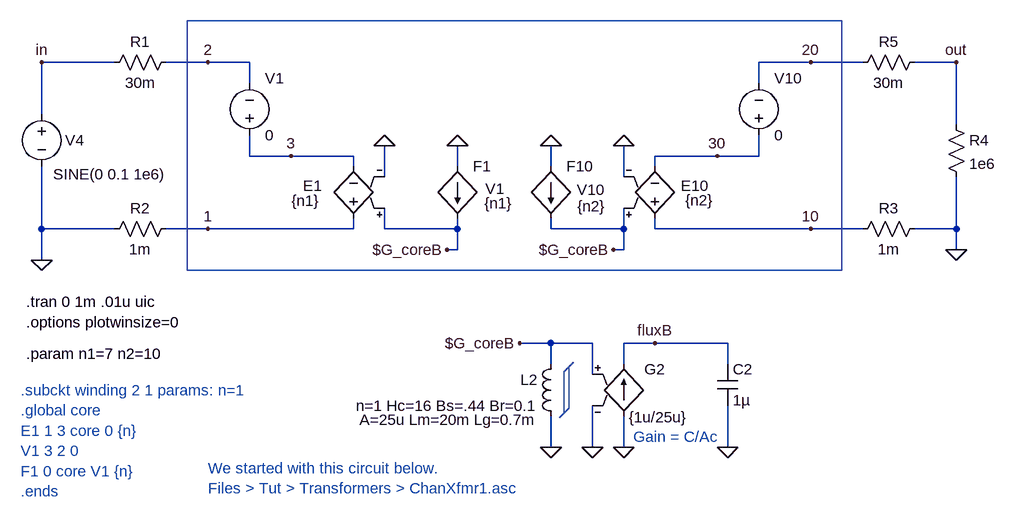
[diagram p0: schematic ChanXfmr_translation1.asc]
ChanXfmr_translation1.asc, the LTspice schematic file:
Version 4
SHEET 1 2500 960
WIRE 1136 112 1024 112
WIRE 1280 112 1216 112
WIRE 1344 112 1280 112
WIRE 2208 112 2128 112
WIRE 2288 112 2208 112
WIRE 2432 112 2368 112
WIRE 1344 144 1344 112
WIRE 2128 144 2128 112
WIRE 1024 192 1024 112
WIRE 2432 208 2432 112
WIRE 1344 256 1344 224
WIRE 1408 256 1344 256
WIRE 1504 256 1408 256
WIRE 2064 256 1968 256
WIRE 2128 256 2128 224
WIRE 2128 256 2064 256
WIRE 1504 272 1504 256
WIRE 1664 272 1664 240
WIRE 1808 272 1808 240
WIRE 1968 272 1968 256
WIRE 1552 288 1552 240
WIRE 1920 288 1920 240
WIRE 1024 368 1024 272
WIRE 1136 368 1024 368
WIRE 1280 368 1216 368
WIRE 1504 368 1504 352
WIRE 1504 368 1280 368
WIRE 1552 368 1552 336
WIRE 1664 368 1664 352
WIRE 1664 368 1552 368
WIRE 1808 368 1808 352
WIRE 1920 368 1920 336
WIRE 1920 368 1808 368
WIRE 1968 368 1968 352
WIRE 2208 368 1968 368
WIRE 2288 368 2208 368
WIRE 2432 368 2432 288
WIRE 2432 368 2368 368
WIRE 1664 400 1664 368
WIRE 1664 400 1648 400
WIRE 1920 400 1920 368
WIRE 1920 400 1904 400
WIRE 2432 400 2432 368
WIRE 1024 416 1024 368
WIRE 1808 544 1760 544
WIRE 1872 544 1808 544
WIRE 1968 544 1920 544
WIRE 2080 544 1968 544
WIRE 1808 576 1808 544
WIRE 1920 576 1920 544
WIRE 2080 576 2080 544
WIRE 1872 592 1872 544
WIRE 1808 704 1808 656
WIRE 1872 704 1872 640
WIRE 1920 704 1920 656
WIRE 2080 704 2080 640
FLAG 1808 704 0
FLAG 1872 704 0
FLAG 1920 704 0
FLAG 2080 704 0
FLAG 1968 544 fluxB
FLAG 1760 544 $G_coreB
FLAG 1648 400 $G_coreB
FLAG 1280 368 1
FLAG 1408 256 3
FLAG 1552 240 0
FLAG 1280 112 2
FLAG 1664 240 0
FLAG 1904 400 $G_coreB
FLAG 2208 368 10
FLAG 2064 256 30
FLAG 1920 240 0
FLAG 2208 112 20
FLAG 1808 240 0
FLAG 1024 416 0
FLAG 2432 400 0
FLAG 1024 112 in
FLAG 2432 112 out
SYMBOL ind 1824 560 M0
WINDOW 123 36 102 Left 0
SYMATTR Value2 A=25u Lm=20m Lg=0.7m
SYMATTR InstName L2
SYMATTR Value n=1 Hc=16 Bs=.44 Br=0.1
SYMBOL g 1920 560 R0
WINDOW 0 32 24 Left 0
WINDOW 3 8 98 Left 0
SYMATTR InstName G2
SYMATTR Value {1u/25u}
SYMBOL cap 2064 576 R0
SYMATTR InstName C2
SYMATTR Value 1µ
SYMBOL e 1504 368 R180
WINDOW 0 48 66 Left 0
WINDOW 3 52 43 Left 0
SYMATTR InstName E1
SYMATTR Value {n1}
SYMBOL voltage 1344 240 M180
WINDOW 0 24 104 Left 0
WINDOW 3 24 16 Left 0
SYMATTR InstName V1
SYMATTR Value 0
SYMBOL f 1664 272 R0
WINDOW 3 43 34 Left 0
WINDOW 123 42 57 Left 0
SYMATTR InstName F1
SYMATTR Value V1
SYMATTR Value2 {n1}
SYMBOL e 1968 368 M180
WINDOW 0 40 66 Left 0
WINDOW 3 47 44 Left 0
SYMATTR InstName E10
SYMATTR Value {n2}
SYMBOL voltage 2128 240 M180
WINDOW 0 24 104 Left 0
WINDOW 3 24 16 Left 0
SYMATTR InstName V10
SYMATTR Value 0
SYMBOL f 1808 272 R0
WINDOW 3 40 36 Left 0
WINDOW 123 41 61 Left 0
SYMATTR InstName F10
SYMATTR Value V10
SYMATTR Value2 {n2}
SYMBOL voltage 1024 176 R0
WINDOW 0 36 56 Left 0
WINDOW 3 18 108 Left 0
WINDOW 123 0 0 Left 0
WINDOW 39 24 176 Left 0
SYMATTR InstName V4
SYMATTR Value SINE(0 0.1 1e6)
SYMBOL res 1120 128 R270
WINDOW 0 32 56 VTop 0
WINDOW 3 0 56 VBottom 0
SYMATTR InstName R1
SYMATTR Value 30m
SYMBOL res 1232 352 R90
WINDOW 0 0 56 VBottom 0
WINDOW 3 32 56 VTop 0
SYMATTR InstName R2
SYMATTR Value 1m
SYMBOL res 2272 384 R270
WINDOW 0 32 56 VTop 0
WINDOW 3 0 56 VBottom 0
SYMATTR InstName R3
SYMATTR Value 1m
SYMBOL res 2416 192 R0
SYMATTR InstName R4
SYMATTR Value 1e6
SYMBOL res 2272 128 R270
WINDOW 0 32 56 VTop 0
WINDOW 3 0 56 VBottom 0
SYMATTR InstName R5
SYMATTR Value 30m
TEXT 2000 672 Top 0 ;Gain = C/Ac
TEXT 1000 480 Left 0 !.tran 0 1m .01u uic
TEXT 1000 512 Left 0 !.options plotwinsize=0
TEXT 992 616 Left 0 ;.subckt winding 2 1 params: n=1\n.global core\nE1 1 3 core 0 {n}\nV1 3 2 0\nF1 0 core V1 {n}\n.ends
TEXT 1000 560 Left 0 !.param n1=7 n2=10
TEXT 1280 736 Left 0 ;We started with this circuit below.\nFiles > Tut > Transformers > ChanXfmr1.asc
LINE Normal 1828 588 1828 652
LINE Normal 1836 580 1836 644
LINE Normal 1843 573 1828 588
LINE Normal 1836 644 1821 659
RECTANGLE Normal 2256 432 1248 48

The netlist it stands for:
* ChanXfmr_translation1.asc
L2 $G_coreB 0 n=1 Hc=16 Bs=.44 Br=0.1 A=25u Lm=20m Lg=0.7m
G2 0 fluxB $G_coreB 0 {1u/25u}
C2 fluxB 0 1µ
E1 1 3 $G_coreB 0 {n1}
V1 3 2 0
F1 0 $G_coreB V1 {n1}
E10 10 30 $G_coreB 0 {n2}
V10 30 20 0
F10 0 $G_coreB V10 {n2}
V4 in 0 SINE(0 0.1 1e6)
R1 in 2 30m
R2 1 0 1m
R3 10 0 1m
R4 out 0 1e6
R5 20 out 30m
* Gain = C/Ac
.tran 0 1m .01u uic
.options plotwinsize=0
* .subckt winding 2 1 params: n=1
* .global core
* E1 1 3 core 0 {n}
* V1 3 2 0
* F1 0 core V1 {n}
* .ends
.param n1=7 n2=10
* We started with this circuit below.
* Files > Tut > Transformers > ChanXfmr1.asc
.backanno
.end